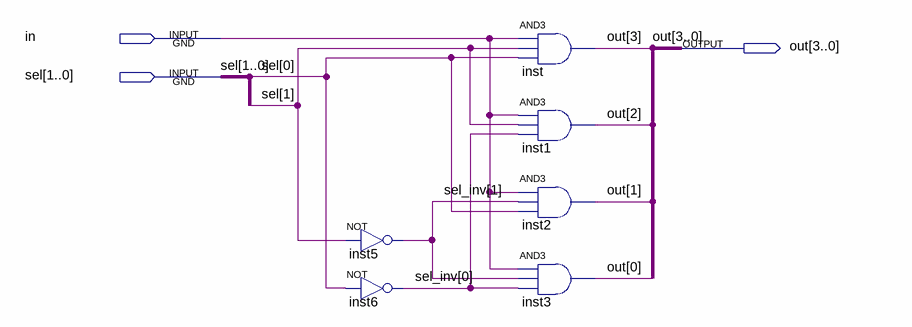
[diagram p0: schematic sheet]
// Quartus schematic demux4.bdf as structural Verilog: 6 symbols, 3 pins
module demux4 (
  input  in,
  input  [1:0] sel,
  output [3:0] out
);

  wire [1:0] sel_inv;

  not inst5 (sel_inv[1], sel[1]);
  not inst6 (sel_inv[0], sel[0]);
  and inst (out[3], in, sel[1], sel[0]);
  and inst1 (out[2], in, sel[1], sel_inv[0]);
  and inst2 (out[1], in, sel_inv[1], sel[0]);
  and inst3 (out[0], in, sel_inv[1], sel_inv[0]);
endmodule
